# Altium schematic sheet QCopterRC_KEY_Sch.SchDoc
size A4
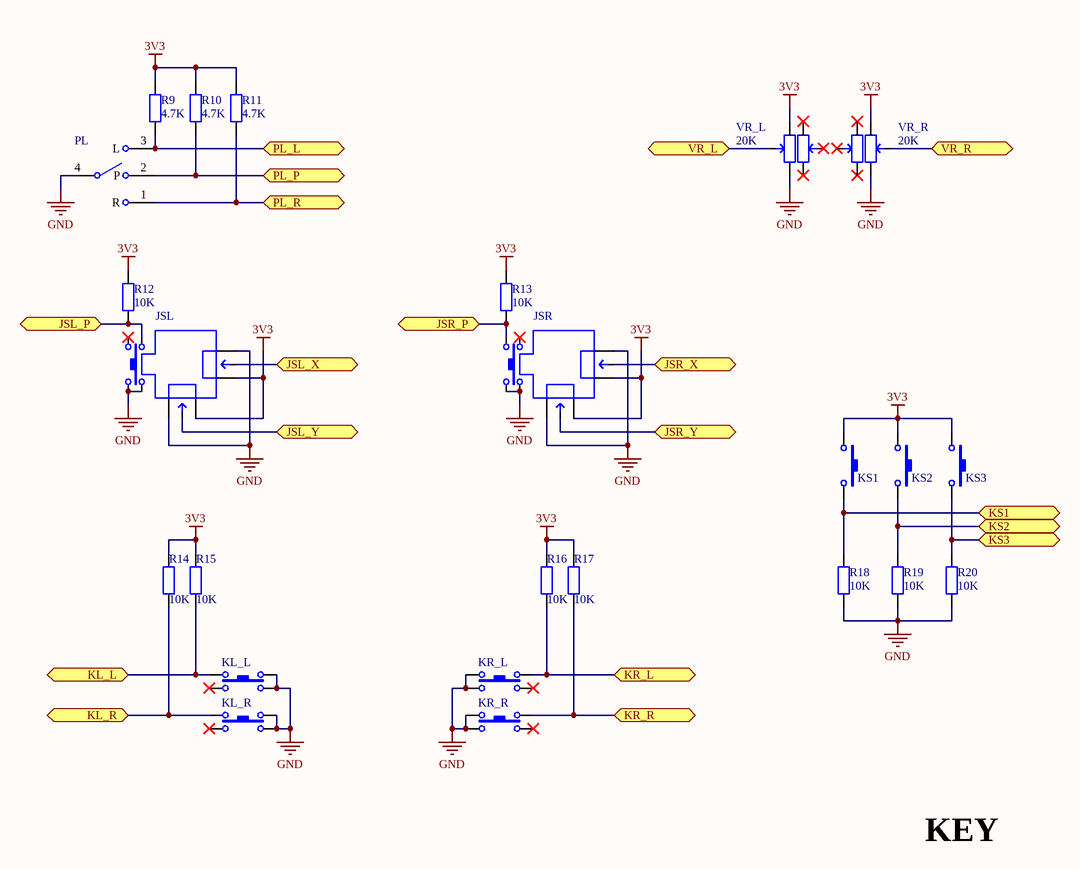
[diagram p0: QCopterRC_KEY_Sch.SchDoc]

## Parts
JSL  JoyStick  [JoyStick]  (value not drawn)
JSR  JoyStick  [JoyStick]  (value not drawn)
KL_L  BT_TACT_12X12_D180  [BT_TACT_12X12_D180]  (value not drawn)
KL_R  BT_TACT_12X12_D180  [BT_TACT_12X12_D180]  (value not drawn)
KR_L  BT_TACT_12X12_D180  [BT_TACT_12X12_D180]  (value not drawn)
KR_R  BT_TACT_12X12_D180  [BT_TACT_12X12_D180]  (value not drawn)
KS1  BT_TACT_3x6_180  [BT_TACT_3x6_180]  (value not drawn)
KS2  BT_TACT_3x6_180  [BT_TACT_3x6_180]  (value not drawn)
KS3  BT_TACT_3x6_180  [BT_TACT_3x6_180]  (value not drawn)
PL  BT_PushLever_11*12_90  [BT_PushLever_11*12_90]  (value not drawn)
R9  value 4.7K  [RES_0603]  (hidden comment: Res_0603)
R10  value 4.7K  [RES_0603]  (hidden comment: Res_0603)
R11  value 4.7K  [RES_0603]  (hidden comment: Res_0603)
R12  value 10K  [RES_0603]  (hidden comment: Res_0603)
R13  value 10K  [RES_0603]  (hidden comment: Res_0603)
R14  value 10K  [RES_0603]  (hidden comment: Res_0603)
R15  value 10K  [RES_0603]  (hidden comment: Res_0603)
R16  value 10K  [RES_0603]  (hidden comment: Res_0603)
R17  value 10K  [RES_0603]  (hidden comment: Res_0603)
R18  value 10K  [RES_0603]  (hidden comment: Res_0603)
R19  value 10K  [RES_0603]  (hidden comment: Res_0603)
R20  value 10K  [RES_0603]  (hidden comment: Res_0603)
VR_L  value 20K  [RES_45MM_DIP]  (hidden comment: RES_45MM_DIP)
VR_R  value 20K  [RES_45MM_DIP]  (hidden comment: RES_45MM_DIP)

## Ports
JSL_P, JSL_X, JSL_Y, JSR_P, JSR_X, JSR_Y, KL_L, KL_R, KR_L, KR_R, KS1, KS2, KS3, PL_L, PL_P, PL_R, VR_L, VR_R

## Nets
3V3: JSL.3 JSL.4 JSR.3 JSR.4 KS1.1 KS2.1 KS3.1 R9.1 R10.1 R11.1 R12.1 R13.1 R14.1 R15.1 R16.1 R17.1 VR_L.1(U) VR_R.3(U)
GND: JSL.1 JSL.6 JSL.8 JSL.10 JSR.1 JSR.6 JSR.8 JSR.10 KL_L.2 KL_L.4 KL_R.2 KL_R.4 KR_L.1 KR_L.3 KR_R.1 KR_R.3 PL.4 R18.2 R19.2 R20.2 VR_L.5(D) VR_R.6(D)
JSL_P: JSL.9 R12.2 ; port JSL_P
JSL_X: JSL.5 ; port JSL_X
JSL_Y: JSL.2 ; port JSL_Y
JSR_P: JSR.7 R13.2 ; port JSR_P
JSR_X: JSR.5 ; port JSR_X
JSR_Y: JSR.2 ; port JSR_Y
KL_L: KL_L.1 R15.2 ; port KL_L
KL_R: KL_R.1 R14.2 ; port KL_R
KR_L: KR_L.2 R16.2 ; port KR_L
KR_R: KR_R.2 R17.2 ; port KR_R
KS1: KS1.2 R18.1 ; port KS1
KS2: KS2.2 R19.1 ; port KS2
KS3: KS3.2 R20.1 ; port KS3
PL_L: PL.3(L) R9.2 ; port PL_L
PL_P: PL.2(P) R10.2 ; port PL_P
PL_R: PL.1(R) R11.2 ; port PL_R
VR_L: VR_L.2(W) ; port VR_L
VR_R: VR_R.4(W) ; port VR_R

Not connected (* = marked no-connect by the designer): JSL 7*; JSR 9*; KL_L 3*; KL_R 3*; KR_L 4*; KR_R 4*; VR_L 3(U)* 4(W)* 6(D)*; VR_R 1(U)* 2(W)* 5(D)*

## Notes on the sheet
- KEY

## Library data of the parts
KL_L KL_R KR_L KR_R = BT_TACT_12X12_D180: Switch
KS1-KS3 = BT_TACT_3x6_180: Switch
PL = BT_PushLever_11*12_90: Switch
R9-R20 = Res_0603: Resistor
VR_L VR_R = RES_45MM_DIP: Resistor